# Altium schematic sheet XMC4500.SchDoc
size A4
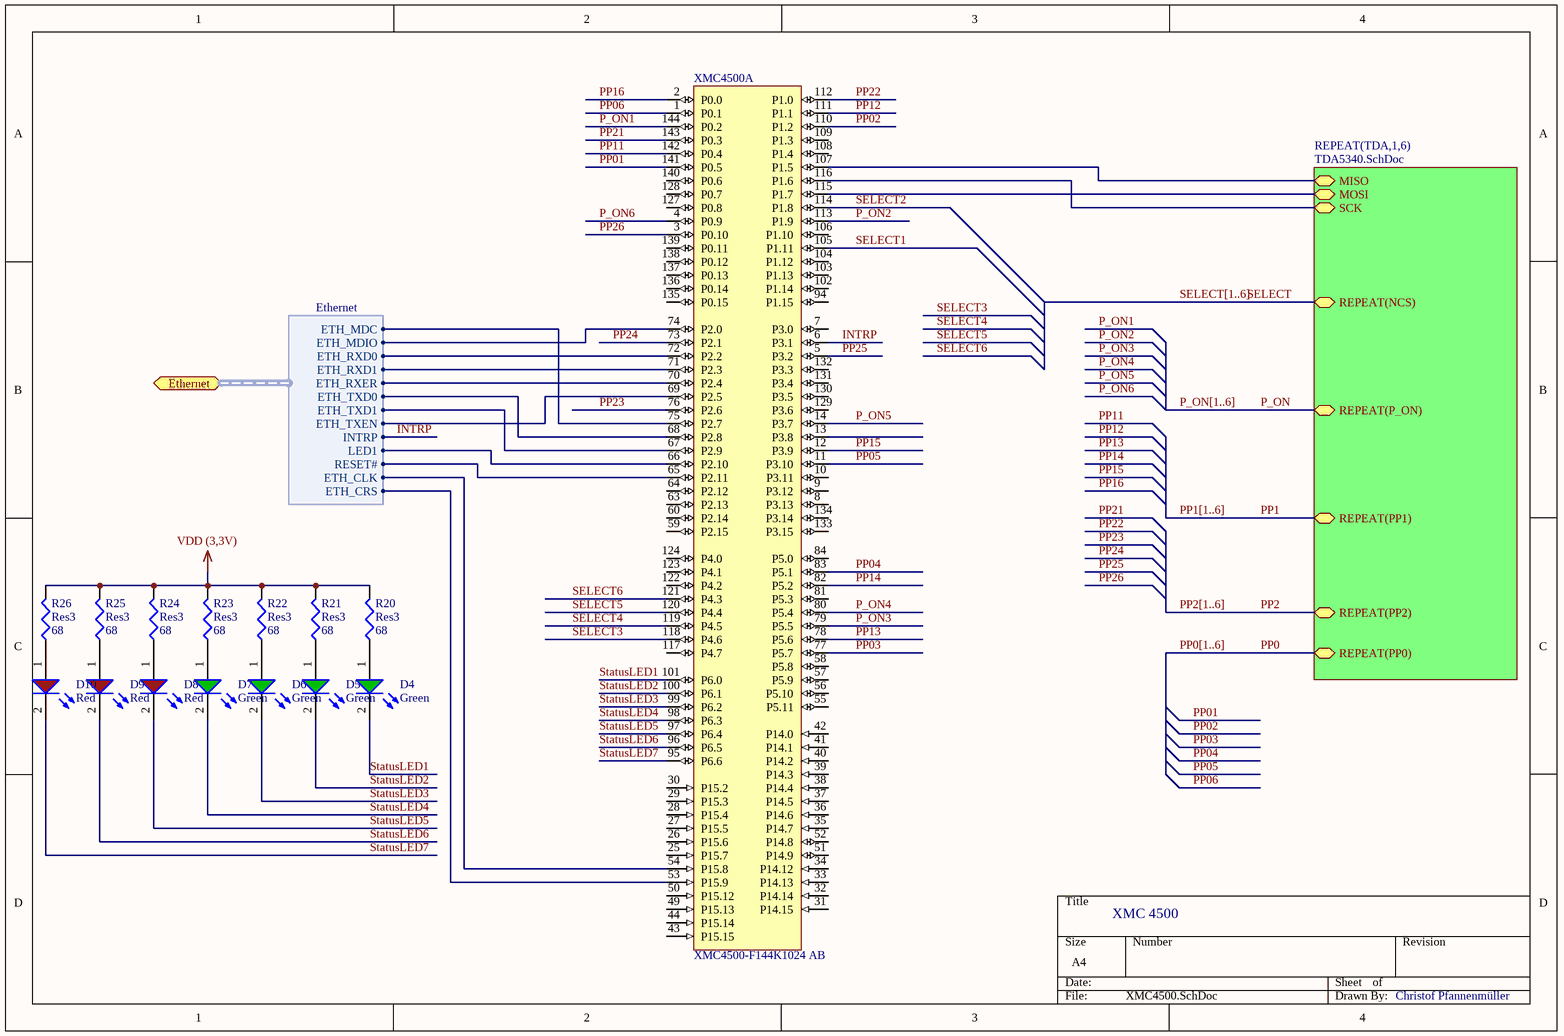
[diagram p0: XMC4500.SchDoc]

## Parts
D4  Green  [LED_0805_Green]
D5  Green  [LED_0805_Green]
D6  Green  [LED_0805_Green]
D7  Green  [LED_0805_Green]
D8  Red  [LED_0805_Red]
D9  Red  [LED_0805_Red]
D10  Red  [LED_0805_Red]
R20  Res3  value 68  [J1-0603]
R21  Res3  value 68  [J1-0603]
R22  Res3  value 68  [J1-0603]
R23  Res3  value 68  [J1-0603]
R24  Res3  value 68  [J1-0603]
R25  Res3  value 68  [J1-0603]
R26  Res3  value 68  [J1-0603]
XMC4500  XMC4500-F144K1024 AB  [INF-PG-LQFP-144-18-6500X6500TP_N]  (part A of 3)

## Sub-sheets
REPEAT(TDA,1,6) = TDA5340.SchDoc: MISO, MOSI, REPEAT(NCS), REPEAT(P_ON), REPEAT(PP2), SCK, REPEAT(PP0), REPEAT(PP1)

## Ports
Ethernet (harness Ethernet)

## Harnesses
Ethernet: ETH_CLK, ETH_CRS, ETH_MDC, ETH_MDIO, ETH_RXD0, ETH_RXD1, ETH_RXER, ETH_TXD0, ETH_TXD1, ETH_TXEN, INTRP, LED1, RESET#

## Nets
VDD (3,3V): R20.2 R21.2 R22.2 R23.2 R24.2 R25.2 R26.2
INTRP: XMC4500.6(P3.1) ; port Ethernet.INTRP
P_ON: sheet REPEAT(TDA,1,6)/REPEAT(P_ON)
P_ON1: XMC4500.144(P0.2)
P_ON2: XMC4500.113(P1.9)
P_ON3: XMC4500.79(P5.5)
P_ON4: XMC4500.80(P5.4)
P_ON5: XMC4500.14(P3.7)
P_ON6: XMC4500.4(P0.9)
PP0: sheet REPEAT(TDA,1,6)/REPEAT(PP0)
PP01: XMC4500.141(P0.5)
PP1: sheet REPEAT(TDA,1,6)/REPEAT(PP1)
PP02: XMC4500.110(P1.2)
PP2: sheet REPEAT(TDA,1,6)/REPEAT(PP2)
PP03: XMC4500.77(P5.7)
PP04: XMC4500.83(P5.1)
PP05: XMC4500.11(P3.10)
PP06: XMC4500.1(P0.1)
PP11: XMC4500.142(P0.4)
PP12: XMC4500.111(P1.1)
PP13: XMC4500.78(P5.6)
PP14: XMC4500.82(P5.2)
PP15: XMC4500.12(P3.9)
PP16: XMC4500.2(P0.0)
PP21: XMC4500.143(P0.3)
PP22: XMC4500.112(P1.0)
PP23: XMC4500.76(P2.6)
PP24: XMC4500.73(P2.1)
PP25: XMC4500.5(P3.2)
PP26: XMC4500.3(P0.10)
SELECT: sheet REPEAT(TDA,1,6)/REPEAT(NCS)
SELECT1: XMC4500.105(P1.11)
SELECT2: XMC4500.114(P1.8)
SELECT3: XMC4500.118(P4.6)
SELECT4: XMC4500.119(P4.5)
SELECT5: XMC4500.120(P4.4)
SELECT6: XMC4500.121(P4.3)
StatusLED1: D4.2(C) XMC4500.101(P6.0)
StatusLED2: D5.2(C) XMC4500.100(P6.1)
StatusLED3: D6.2(C) XMC4500.99(P6.2)
StatusLED4: D7.2(C) XMC4500.98(P6.3)
StatusLED5: D8.2(C) XMC4500.97(P6.4)
StatusLED6: D9.2(C) XMC4500.96(P6.5)
StatusLED7: D10.2(C) XMC4500.95(P6.6)
NetD4_1: D4.1(A) R20.1
NetD5_1: D5.1(A) R21.1
NetD6_1: D6.1(A) R22.1
NetD7_1: D7.1(A) R23.1
NetD8_1: D8.1(A) R24.1
NetD9_1: D9.1(A) R25.1
NetD10_1: D10.1(A) R26.1
NetXMC4500_53: XMC4500.53(P15.9) ; port Ethernet.ETH_CRS
NetXMC4500_54: XMC4500.54(P15.8) ; port Ethernet.ETH_CLK
NetXMC4500_65: XMC4500.65(P2.11) ; port Ethernet.RESET#
NetXMC4500_66: XMC4500.66(P2.10) ; port Ethernet.LED1
NetXMC4500_67: XMC4500.67(P2.9) ; port Ethernet.ETH_TXD1
NetXMC4500_68: XMC4500.68(P2.8) ; port Ethernet.ETH_TXD0
NetXMC4500_69: XMC4500.69(P2.5) ; port Ethernet.ETH_TXEN
NetXMC4500_70: XMC4500.70(P2.4) ; port Ethernet.ETH_RXER
NetXMC4500_71: XMC4500.71(P2.3) ; port Ethernet.ETH_RXD1
NetXMC4500_72: XMC4500.72(P2.2) ; port Ethernet.ETH_RXD0
NetXMC4500_74: XMC4500.74(P2.0) ; port Ethernet.ETH_MDIO
NetXMC4500_75: XMC4500.75(P2.7) ; port Ethernet.ETH_MDC
NetXMC4500_107: XMC4500.107(P1.5) ; sheet REPEAT(TDA,1,6)/MISO
NetXMC4500_115: XMC4500.115(P1.7) ; sheet REPEAT(TDA,1,6)/MOSI
NetXMC4500_116: XMC4500.116(P1.6) ; sheet REPEAT(TDA,1,6)/SCK

Not connected (* = marked no-connect by the designer): XMC4500 7(P3.0) 8(P3.13) 9(P3.12) 10(P3.11) 13(P3.8) 25(P15.7) 26(P15.6) 27(P15.5) 28(P15.4) 29(P15.3) 30(P15.2) 31(P14.15) 32(P14.14) 33(P14.13) 34(P14.12) 35(P14.7) 36(P14.6) 37(P14.5) 38(P14.4) 39(P14.3) 40(P14.2) 41(P14.1) 42(P14.0) 43(P15.15) 44(P15.14) 49(P15.13) 50(P15.12) 51(P14.9) 52(P14.8) 55(P5.11) 56(P5.10) 57(P5.9) 58(P5.8) 59(P2.15) 60(P2.14) 63(P2.13) 64(P2.12) 81(P5.3) 84(P5.0) 94(P1.15) 102(P1.14) 103(P1.13) 104(P1.12) 106(P1.10) 108(P1.4) 109(P1.3) 117(P4.7) 122(P4.2) 123(P4.1) 124(P4.0) 127(P0.8) 128(P0.7) 129(P3.6) 130(P3.5) 131(P3.4) 132(P3.3) 133(P3.15) 134(P3.14) 135(P0.15) 136(P0.14) 137(P0.13) 138(P0.12) 139(P0.11) 140(P0.6)

## Buses and harness runs
bus P_ON[1..6]
bus PP0[1..6]
bus PP1[1..6]
bus PP2[1..6]
bus SELECT[1..6]

## Notes on the sheet
- XMC 4500
- Christof Pfannenmüller

## Library data of the parts
D4-D7 = WL-SMCW 0805  150080GS75000: SMD mono-color Chip LED, WL-SMCW, Green; Manufacturer: W黵th Elektronik eiSos GmbH; PartNo: 150080GS75000; ComponentLink1Description: Manufacturer; ComponentLink1URL: http://www.we-online.de; Created by: Christin Otto; Created Date: June 2013; ComponentLink2Description: Datasheet; ComponentLink2URL: http://katalog.we-online.com/led/datasheet/150080GS75000.pdf; Color: Green
D8-D10 = WL-SMCW 0805  150080RS75000: SMD mono-color Chip LED, WL-SMCW, Red; Manufacturer: W黵th Elektronik eiSos GmbH; PartNo: 150080RS75000; ComponentLink1Description: Manufacturer; ComponentLink1URL: http://www.we-online.de; Created by: Christin Otto; Created Date: June 2013; ComponentLink2Description: Datasheet; ComponentLink2URL: http://katalog.we-online.com/led/datasheet/150080RS75000.pdf; Color: Red
R20-R26 = Res3: Resistor; Published: 8-Jun-2000; LatestRevisionDate: 29-May-2009; LatestRevisionNote: IPC-7351 Footprint Added.; PackageReference: J1-0603; Publisher: Altium Limited; PackageDescription: Chip Resistor
XMC4500 = XMC4500-F144K1024 AB: 120 MHz XMC4500 MCU with 1,024 KByte Program Memory, 160 KByte SRAM, 3.3 V, -40 to 125 degC, PG-LQFP-144, Green; Manufacturer: Infineon; A / D input lines (incl. FADC): 26; Digital I/O Lines: 91; Program Memory: 1,024.0 KByte; SRAM (incl. Cache): 160.0 KByte; Type of Serial I/O Interfaces: 6xSPI, Dual SPI, Quad SPI, UART, LIN, IIC, IIS; DatasheetVersion: V1.0; PackageVersion: V1.0; PackageReference: PG-LQFP-144-18; PackageDescription: 144-Pin Plastic (Green) Low Profile Quad Flat Package, 20 x 20 mm Body, 0.5 mm Pitch; Halogen-free: TRUE; Mounting Technology: Surface Mount; PartNumber: XMC4500-F144K1024 AB; ComponentLink1Description: Manufacturer URL; ComponentLink1URL: http://www.infineon.com; ComponentLink2Description: Datasheet; ComponentLink2URL: http://www.infineon.com/dgdl/xmc4500_ds_v1+0_2013_01.pdf?folderId=db3a30433580b3710135a47f3eb76c98&fileId=db3a304335b504400135bdca7ed86742&location=en.Products.Microcontrollers.32-bit_Industrial_Microcontrollers_based_on_ARM__Cortex_-M.32-bit_XMC4000_Industrial_Microcontrollers_ARM__Cortex_-M4.DATASHEET.xmc4500_ds_v1 0_2013_01.pdf; ComponentLink3Description: Package Specification; ComponentLink3URL: http://www.infineon.com/cms/packages/SMD_-_Surface_Mounted_Devices/P-PG-LQFP/P-PG-LQFP-144-04x_13x_14x_15x_16x_18.html?__locale=en